# Altium schematic sheet SwitchingPowerSupplyCourse.SchDoc
size A3
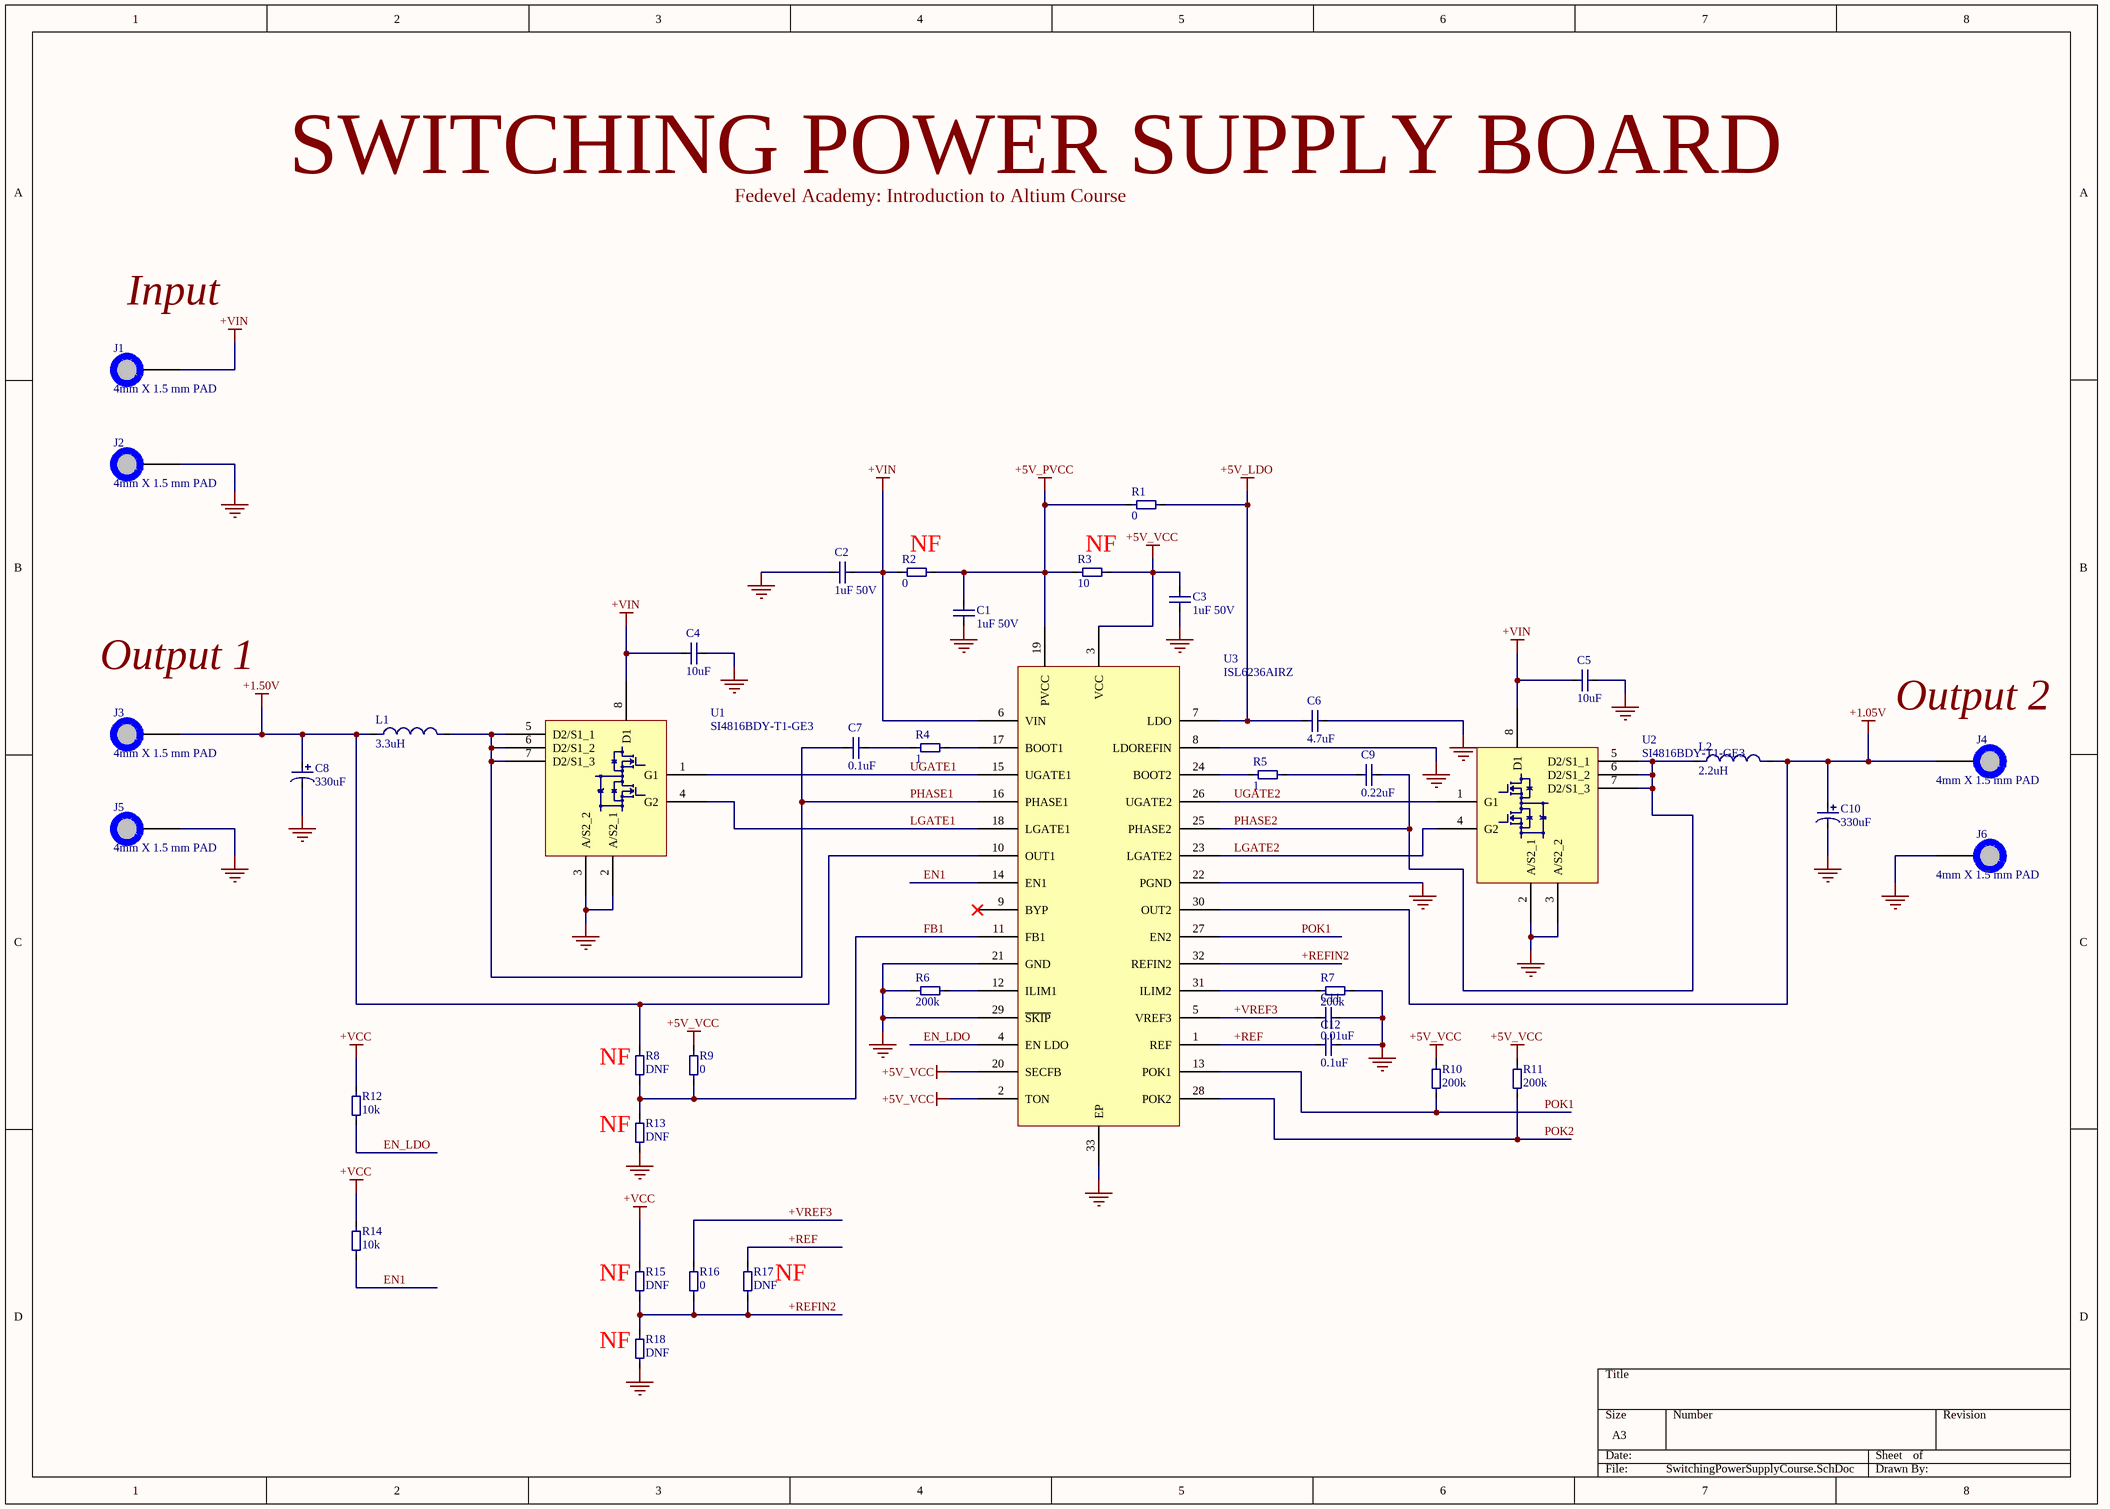
[diagram p0: SwitchingPowerSupplyCourse.SchDoc]

## Parts
C1  1uF 50V  [C0805]
C2  1uF 50V  [C0805]
C3  1uF 50V  [C0805]
C4  10uF  [C1210]
C5  10uF  [C1210]
C6  4.7uF  [C1206]
C7  0.1uF  [C0805]
C8  330uF  [7343-31]
C9  0.22uF  [C0805]
C10  330uF  [7343-31]
C11  0.01uF  [C0805]
C12  0.1uF  [C0805]
J1  4mm X 1.5 mm PAD  [PAD_WITH_HOLE_4mmX1.5mm]
J2  4mm X 1.5 mm PAD  [PAD_WITH_HOLE_4mmX1.5mm]
J3  4mm X 1.5 mm PAD  [PAD_WITH_HOLE_4mmX1.5mm]
J4  4mm X 1.5 mm PAD  [PAD_WITH_HOLE_4mmX1.5mm]
J5  4mm X 1.5 mm PAD  [PAD_WITH_HOLE_4mmX1.5mm]
J6  4mm X 1.5 mm PAD  [PAD_WITH_HOLE_4mmX1.5mm]
L1  3.3uH  [SRP1265A]
L2  2.2uH  [SRP1265A]
R1  0  [R0805]
R2  0  [R0805]
R3  10  [R0805]
R4  1  [R0805]
R5  1  [R0805]
R6  200k  [R0805]
R7  200k  [R0805]
R8  DNF  [R0805]
R9  0  [R0805]
R10  200k  [R0805]
R11  200k  [R0805]
R12  10k  [R0805]
R13  DNF  [R0805]
R14  10k  [R0805]
R15  DNF  [R0805]
R16  0  [R0805]
R17  DNF  [R0805]
R18  DNF  [R0805]
U1  SI4816BDY-T1-GE3  [SO-8]
U2  SI4816BDY-T1-GE3  [SO-8]
U3  ISL6236AIRZ  [L32.5x5B]

## Nets
+1.05V: C10.1 J4.1 L2.2 U3.30(OUT2)
+1.50V: C8.1 J3.1 L1.1 R8.2 U3.10(OUT1)
+5V_LDO: C6.2 R1.2 U3.7(LDO)
+5V_PVCC: C1.2 R1.1 R2.2 R3.1 U3.19(PVCC)
+5V_VCC: C3.1 R3.2 R9.2 R10.1 R11.1 U3.2(TON) U3.3(VCC) U3.20(SECFB)
+VCC: R12.2 R14.2 R15.2
+VIN: C2.2 C4.1 C5.1 J1.1 R2.1 U1.8(D1) U2.8(D1) U3.6(VIN)
GND: C1.1 C2.1 C3.2 C4.2 C5.2 C6.1 C8.2 C10.2 C11.2 C12.2 J2.1 J5.1 J6.1 R6.1 R7.2 R13.1 R18.1 U1.2(A/S2_1) U1.3(A/S2_2) U2.2(A/S2_1) U2.3(A/S2_2) U3.8(LDOREFIN) U3.21(GND) U3.22(PGND) U3.29(~{SKIP}) U3.33(EP)
+REF: C12.1 R17.2 U3.1(REF)
+REFIN2: R15.1 R16.1 R17.1 R18.2 U3.32(REFIN2)
+VREF3: C11.1 R16.2 U3.5(VREF3)
EN1: R14.1 U3.14(EN1)
EN_LDO: R12.1 U3.4(EN_LDO)
FB1: R8.1 R9.1 R13.2 U3.11(FB1)
LGATE1: U1.4(G2) U3.18(LGATE1)
LGATE2: U2.4(G2) U3.23(LGATE2)
PHASE1: C7.1 L1.2 U1.5(D2/S1_1) U1.6(D2/S1_2) U1.7(D2/S1_3) U3.16(PHASE1)
PHASE2: C9.2 L2.1 U2.5(D2/S1_1) U2.6(D2/S1_2) U2.7(D2/S1_3) U3.25(PHASE2)
POK1: R10.2 U3.13(POK1) U3.27(EN2)
POK2: R11.2 U3.28(POK2)
UGATE1: U1.1(G1) U3.15(UGATE1)
UGATE2: U2.1(G1) U3.26(UGATE2)
NetC7_2: C7.2 R4.1
NetC9_1: C9.1 R5.2
NetR4_2: R4.2 U3.17(BOOT1)
NetR5_1: R5.1 U3.24(BOOT2)
NetR6_2: R6.2 U3.12(ILIM1)
NetR7_1: R7.1 U3.31(ILIM2)

Not connected (* = marked no-connect by the designer): U3 9(BYP)*

## Notes on the sheet
- SWITCHING POWER SUPPLY BOARD
- Fedevel Academy: Introduction to Altium Course
- Input
- (near R2) NF
- (near R3) NF
- Output 1
- (near J4) Output 2
- (near R8) NF
- (near R13) NF
- (near R15) NF
- (near R17) NF
- (near R18) NF

## Library data of the parts
C1-C3 = UMK212F105ZG-T: Multilayer Ceramic Capacitors MLCC - SMD/SMT CAP MLCC 0805 50V Y5V 1uF +80/-20%; Manufacturer: Taiyo Yuden; Tolerance: - 20 %, + 80 %; Type: Industrial/Automotive and Safety; Case Height: 1.25 mm; Case Length: 2 mm; Supplier 1: Mouser; Manufacturer Part Number: UMK212F105ZG-T; RoHS: RoHS Compliant; Category: Multilayer Ceramic Capacitors MLCC - SMD/SMT; Stock 1: 113811; Pricing 1: 1=0.088, 10=0.036, 100=0.022, 1000=0.017, 3000=0.013, 9000=0.011, 45000=0.010 (EUR); Capacitance: 1 uF; Operating Temperature Range: - 55 C to + 125 C; Package/Case: 0805 (2012 metric); Packaging: Reel; Product: General Type MLCCs; Series: M; Termination Style: SMD/SMT; Voltage Rating: 50 V; Brand: Taiyo Yuden; Case Code - in: 0805; Case Code - mm: 2012; Case Width: 1.25 mm; Standard Pack Qty: 3000; Temperature Coefficient/Code: Y5V; RoHS - Mouser: Y; Minimum Order Quantity: 1; Reeling: True; ComponentLink1URL: http://www.yuden.co.jp/productdata/catalog/en/mlcc01_e.pdf; ComponentLink1Description: http://www.yuden.co.jp/productdata/catalog/en/mlcc01_e.pdf
C4 C5 = UMK325BJ106MM-T: Multilayer Ceramic Capacitors MLCC - SMD/SMT CAP MLCC 1210 50V X5R 10uF 20%; Manufacturer: Taiyo Yuden; Type: Industrial/Automotive and Safety; Case Height: 2.5 mm; Case Length: 3.2 mm; Supplier 1: Mouser; Manufacturer Part Number: UMK325BJ106MM-T; RoHS: RoHS Compliant; Category: Multilayer Ceramic Capacitors MLCC - SMD/SMT; Stock 1: 208606; Pricing 1: 1=0.448, 10=0.256, 100=0.128, 500=0.128, 1000=0.102, 5000=0.096, 10000=0.088, 25000=0.086, 50000=0.083, 100000=0.081 (EUR); Capacitance: 10 uF; Operating Temperature Range: - 55 C to + 125 C; Package/Case: 1210 (3225 metric); Packaging: Reel; Product: General Type MLCCs; Series: M; Termination Style: SMD/SMT; Tolerance: 20 %; Voltage Rating: 50 V; Brand: Taiyo Yuden; Case Code - in: 1210; Case Code - mm: 3225; Case Width: 2.5 mm; Standard Pack Qty: 500; Temperature Coefficient/Code: X5R; RoHS - Mouser: Y; Minimum Order Quantity: 1; Reeling: True; ComponentLink1URL: http://www.yuden.co.jp/productdata/catalog/en/mlcc01_e.pdf; ComponentLink1Description: http://www.yuden.co.jp/productdata/catalog/en/mlcc01_e.pdf
C6 = 1206ZD475KAT2A: Multilayer Ceramic Capacitors MLCC - SMD/SMT 1206 4.7uF 10volts X5R 10%; Manufacturer: AVX; Type: Commercial Surface Mount Chip; Voltage Rating: 10 V; Case Height: 0.07 mm; Case Length: 3.2 mm; Case Width: 1.6 mm; Supplier 1: Mouser; Manufacturer Part Number: 1206ZD475KAT2A; RoHS: RoHS Compliant By Exemption; Category: Multilayer Ceramic Capacitors MLCC - SMD/SMT; Stock 1: 2430; Pricing 1: 1=0.216, 50=0.172, 100=0.091, 500=0.074, 1000=0.068, 2000=0.061, 4000=0.056, 8000=0.054, 12000=0.046 (EUR); Capacitance: 4.7 uF; Operating Temperature Range: - 55 C to + 85 C; Package/Case: 1206 (3216 metric); Packaging: Reel; Product: General Type MLCCs; Series: 1206; Termination Style: SMD/SMT; Tolerance: 10 %; Brand: AVX; Case Code - in: 1206; Case Code - mm: 3216; Product Category: High Capacitance SMD Ceramic Chip Capacitors; Standard Pack Qty: 2000; Temperature Coefficient/Code: X5R; RoHS - Mouser: E; Minimum Order Quantity: 1; Reeling: True; ComponentLink1URL: http://www.avx.com/docs/Catalogs/cx5r.pdf; ComponentLink1Description: http://www.avx.com/docs/Catalogs/cx5r.pdf
C7 C12 = 0805J0500104KJT: Multilayer Ceramic Capacitors MLCC - SMD/SMT 50volts 0.1uF 10%; Manufacturer: Syfer; Type: X7R MLC Capacitor; Voltage Rating: 50 V; Temperature Coefficient/Code: X7R; Product Status: New at Mouser; Supplier 1: Mouser; Manufacturer Part Number: 0805J0500104KJT; RoHS: RoHS Compliant; Category: Multilayer Ceramic Capacitors MLCC - SMD/SMT; Stock 1: 0; Pricing 1: 1=0.048, 50=0.047, 100=0.044, 500=0.041, 1000=0.034, 3000=0.030, 6000=0.029, 9000=0.027, 12000=0.022 (EUR); Capacitance: 0.1 uF; Operating Temperature Range: - 55 C to + 125 C; Package/Case: 0805 (2012 metric); Packaging: Reel; Product: General Type MLCCs; Series: PSL; Termination Style: SMD/SMT; Tolerance: 10 %; Brand: Syfer; Case Code - in: 0805; Case Code - mm: 2012; Maximum Operating Temperature: + 125 C; Minimum Operating Temperature: - 55 C; RoHS - Mouser: Y; Minimum Order Quantity: 1; Reeling: True; ComponentLink1URL: http://www.mouser.com/ds/2/394/SL-335134.pdf; ComponentLink1Description: http://www.mouser.com/ds/2/394/SL-335134.pdf
C8 C10 = T495D337K010ATE150: Tantalum Capacitors - Solid SMD 10volts 330uF 10% ESR=150mOhms; Manufacturer: Kemet; Mfr Case Code: D Case; Voltage Rating: 10 V; Case Length: 7.3 mm; Case Width: 4.3 mm; Supplier 1: Mouser; Manufacturer Part Number: T495D337K010ATE150; RoHS: RoHS Compliant; Category: Tantalum Capacitors - Solid SMD; Stock 1: 11010; Pricing 1: 1=1.47, 10=1.01, 100=0.777, 500=0.660, 1000=0.582, 2500=0.546 (EUR); Capacitance: 330 uF; Height: 3.1 mm; Operating Temperature Range: - 55 C to + 125 C; Package/Case: 2917 (7343 metric); Packaging: Reel; Product: Tantalum Solid Low ESR Industrial Grade; Series: T495; Termination Style: SMD/SMT; Tolerance: 10 %; Brand: Kemet; ESR: 150 mOhms; Case Code - in: 2917; Case Code - mm: 7343; Product Category: SMD Low ESR Tantalum Chip Capacitors; Standard Pack Qty: 500; RoHS - Mouser: Y; Minimum Order Quantity: 1; Reeling: True; ComponentLink1URL: http://www.mouser.com/ds/2/212/KEM_T2009_T495-225625.pdf; ComponentLink1Description: http://www.mouser.com/ds/2/212/KEM_T2009_T495-225625.pdf
C9 = UMK212B7224KG-T: Multilayer Ceramic Capacitors MLCC - SMD/SMT CAP MLCC 0805 50V X7R 0.22uF 10%; Manufacturer: Taiyo Yuden; Type: Industrial/Automotive and Safety; Case Height: 1.25 mm; Case Length: 2 mm; Supplier 1: Mouser; Manufacturer Part Number: UMK212B7224KG-T; RoHS: RoHS Compliant; Category: Multilayer Ceramic Capacitors MLCC - SMD/SMT; Stock 1: 25331; Pricing 1: 1=0.096, 10=0.038, 100=0.022, 1000=0.018, 3000=0.014, 9000=0.013, 24000=0.012, 99000=0.011 (EUR); Capacitance: 0.22 uF; Operating Temperature Range: - 55 C to + 125 C; Package/Case: 0805 (2012 metric); Packaging: Reel; Product: General Type MLCCs; Series: M; Termination Style: SMD/SMT; Tolerance: 10 %; Voltage Rating: 50 V; Brand: Taiyo Yuden; Case Code - in: 0805; Case Code - mm: 2012; Case Width: 1.25 mm; Standard Pack Qty: 3000; Temperature Coefficient/Code: X7R; RoHS - Mouser: Y; Minimum Order Quantity: 1; Reeling: True; ComponentLink1URL: http://www.yuden.co.jp/productdata/catalog/en/mlcc01_e.pdf; ComponentLink1Description: http://www.yuden.co.jp/productdata/catalog/en/mlcc01_e.pdf
C11 = VJ0805Y103JXAPW1BC: Multilayer Ceramic Capacitors MLCC - SMD/SMT 0805 0.01uF 50volts X7R 5%; Manufacturer: Vishay / Vitramon; Type: Ultra Small Commodity MLCCs; Voltage Rating: 50 V; Case Height: 1.45 mm; Case Length: 2 mm; Case Width: 1.25 mm; Dissipation Factor DF: 2.5; Supplier 1: Mouser; Manufacturer Part Number: VJ0805Y103JXAPW1BC; RoHS: RoHS Compliant; Category: Multilayer Ceramic Capacitors MLCC - SMD/SMT; Stock 1: 9873; Pricing 1: 1=0.048, 50=0.016, 100=0.013, 500=0.011, 1000=0.010, 15000=0.008, 75000=0.007 (EUR); Capacitance: 0.01 uF; Operating Temperature Range: - 55 C to + 125 C; Package/Case: 0805 (2012 metric); Packaging: Reel; Product: General Type MLCCs; Series: VJ W1BC; Termination Style: SMD/SMT; Tolerance: 5 %; Brand: Vishay / Vitramon; Case Code - in: 0805; Case Code - mm: 2012; Product Category: Ceramic Chip Capacitors; Standard Pack Qty: 15000; Temperature Coefficient/Code: X7R; RoHS - Mouser: Y; Minimum Order Quantity: 1; Reeling: True; ComponentLink1URL: http://www.mouser.com/ds/2/427/vjw1bcbascomseries-223529.pdf; ComponentLink1Description: http://www.mouser.com/ds/2/427/vjw1bcbascomseries-223529.pdf
J1-J6 = 4mmX1.5mm_PAD: Elliptical pad 4mm x 1.5 mm
L1 = SRP1265A-3R3M: Fixed Inductors 3.3uH 20% SMD 1265; Manufacturer: Bourns; Core Material: Carbonyl Iron Powder; Maximum DC Current: 30 A; Maximum DC Resistance: 6.8 mOhms; Shielding: Shielded; Type: Shielded Power Inductor; Case Height: 6.2 mm; Case Length: 13.5 mm; Case Width: 12.5 mm; Test Frequency: 100 kHz; Product Status: New at Mouser; Supplier 1: Mouser; Manufacturer Part Number: SRP1265A-3R3M; RoHS: RoHS Compliant; Category: Fixed Inductors; Stock 1: 500; Pricing 1: 1=1.19, 10=0.959, 50=0.889, 100=0.847, 250=0.773, 500=0.535, 1000=0.526, 2500=0.513, 5000=0.483 (EUR); Inductance: 3.3 uH; Operating Temperature Range: - 40 C to + 150 C; Packaging: Reel; Product: Power Inductors; Series: SRP1265A; Termination Style: SMD/SMT; Tolerance: 20 %; Brand: Bourns; RoHS - Mouser: Y; Minimum Order Quantity: 1; Reeling: True; ComponentLink1URL: http://www.mouser.com/ds/2/54/bourns_SRP1265A-338573.pdf; ComponentLink1Description: http://www.mouser.com/ds/2/54/bourns_SRP1265A-338573.pdf
L2 = SRP1265A-2R2M: Fixed Inductors 2.2uH 20% SMD 1265; Manufacturer: Bourns; Core Material: Carbonyl Iron Powder; Maximum DC Current: 37 A; Maximum DC Resistance: 4.2 mOhms; Shielding: Shielded; Type: Shielded Power Inductor; Case Height: 6.2 mm; Case Length: 13.5 mm; Case Width: 12.5 mm; Test Frequency: 100 kHz; Product Status: New at Mouser; Supplier 1: Mouser; Manufacturer Part Number: SRP1265A-2R2M; RoHS: RoHS Compliant; Category: Fixed Inductors; Stock 1: 246; Pricing 1: 1=1.19, 10=0.959, 50=0.889, 100=0.847, 250=0.773, 500=0.535, 1000=0.526, 2500=0.513, 5000=0.483 (EUR); Inductance: 2.2 uH; Operating Temperature Range: - 40 C to + 150 C; Packaging: Reel; Product: Power Inductors; Series: SRP1265A; Termination Style: SMD/SMT; Tolerance: 20 %; Brand: Bourns; RoHS - Mouser: Y; Minimum Order Quantity: 1; Reeling: True; ComponentLink1URL: http://www.mouser.com/ds/2/54/bourns_SRP1265A-338573.pdf; ComponentLink1Description: http://www.mouser.com/ds/2/54/bourns_SRP1265A-338573.pdf
R1 R2 R9 R16 = RK73Z2ATTD: Thick Film Resistors - SMD ZEROohms JUMPER; Manufacturer: KOA Speer; Resistance: 0 Ohms; Case Height: 0.5 mm; Case Length: 2 mm; Case Width: 1.25 mm; Supplier 1: Mouser; Manufacturer Part Number: RK73Z2ATTD; RoHS: RoHS Compliant By Exemption; Category: Thick Film Resistors - SMD; Stock 1: 872384; Pricing 1: 1=0.064, 10=0.010, 100=0.005, 1000=0.003, 5000=0.002 (EUR); Operating Temperature Range: - 55 C to + 155 C; Package/Case: 0805 (2012 metric); Packaging: Reel; Power Rating: -; Product: Thick Film Resistors Zero-Ohm; Series: RK73Z; Temperature Coefficient: -; Tolerance: -; Voltage Rating: -; Brand: KOA Speer; Case Code - in: 0805; Case Code - mm: 2012; Product Category: 0805 SMD Thick Film Chip Resistors; Standard Pack Qty: 5000; RoHS - Mouser: E; Minimum Order Quantity: 1; Reeling: True; ComponentLink1URL: http://www.mouser.com/ds/2/219/RK73Z-11765.pdf; ComponentLink1Description: http://www.mouser.com/ds/2/219/RK73Z-11765.pdf
R3 = CRCW080510R0FKEA: Thick Film Resistors - SMD 1/8watt 10ohms 1% 100ppm; Manufacturer: Vishay / Dale; Power Rating: 125 mW (1/8 W); Temperature Coefficient: 100 PPM / K; Voltage Rating: 150 V; Case Height: 0.45 mm; Case Length: 2 mm; Case Width: 1.25 mm; Supplier 1: Mouser; Manufacturer Part Number: CRCW080510R0FKEA; RoHS: RoHS Compliant By Exemption; Category: Thick Film Resistors - SMD; Stock 1: 355552; Pricing 1: 1=0.064, 10=0.038, 100=0.022, 1000=0.014, 5000=0.004, 100000=0.003 (EUR); Operating Temperature Range: - 55 C to + 155 C; Package/Case: 0805 (2012 metric); Packaging: Reel; Product: Thick Film Resistors SMD; Resistance: 10 Ohms; Series: CRCW; Tolerance: 1 %; Brand: Vishay / Dale; Case Code - in: 0805; Case Code - mm: 2012; Product Category: 0805 Thick Film Chip Resistors; Standard Pack Qty: 5000; RoHS - Mouser: E; Minimum Order Quantity: 1; Reeling: True; ComponentLink1URL: http://www.mouser.com/ds/2/427/dcrcwe3-109170.pdf; ComponentLink1Description: http://www.mouser.com/ds/2/427/dcrcwe3-109170.pdf
R4 R5 = CRCW08051R00FKEA: Thick Film Resistors - SMD 1/8watt 1ohms 100ppm; Manufacturer: Vishay / Dale; Power Rating: 125 mW (1/8 W); Temperature Coefficient: 100 PPM / K; Tolerance: 1 %; Voltage Rating: 150 V; Case Height: 0.45 mm; Case Length: 2 mm; Case Width: 1.25 mm; Supplier 1: Mouser; Manufacturer Part Number: CRCW08051R00FKEA; RoHS: RoHS Compliant By Exemption; Category: Thick Film Resistors - SMD; Stock 1: 93546; Pricing 1: 1=0.064, 10=0.038, 100=0.022, 1000=0.014, 5000=0.004, 100000=0.003 (EUR); Operating Temperature Range: - 55 C to + 155 C; Package/Case: 0805 (2012 metric); Packaging: Reel; Product: Thick Film Resistors SMD; Resistance: 1 Ohms; Series: CRCW; Brand: Vishay / Dale; Case Code - in: 0805; Case Code - mm: 2012; Product Category: 0805 Thick Film Chip Resistors; Standard Pack Qty: 5000; RoHS - Mouser: E; Minimum Order Quantity: 1; Reeling: True; ComponentLink1URL: http://www.mouser.com/ds/2/427/dcrcwe3-109170.pdf; ComponentLink1Description: http://www.mouser.com/ds/2/427/dcrcwe3-109170.pdf
R6 R7 R10 R11 = RK73H2ATTD2003F: Thick Film Resistors - SMD 1/8watts 200Kohms 1%; Manufacturer: KOA Speer; Power Rating: 125 mW (1/8 W); Temperature Coefficient: 100 PPM / C; Voltage Rating: 150 V; Case Height: 0.5 mm; Case Length: 2 mm; Case Width: 1.25 mm; Supplier 1: Mouser; Manufacturer Part Number: RK73H2ATTD2003F; RoHS: RoHS Compliant By Exemption; Category: Thick Film Resistors - SMD; Stock 1: 67759; Pricing 1: 1=0.064, 10=0.011, 100=0.006, 5000=0.003, 10000=0.002 (EUR); Operating Temperature Range: - 55 C to + 155 C; Package/Case: 0805 (2012 metric); Packaging: Reel; Product: Thick Film Resistors SMD; Resistance: 200 kOhms; Series: RK73H; Tolerance: 1 %; Brand: KOA Speer; Case Code - in: 0805; Case Code - mm: 2012; Product Category: 0805 SMD Thick Film Chip Resistors; Standard Pack Qty: 5000; RoHS - Mouser: E; Minimum Order Quantity: 1; Reeling: True; ComponentLink1URL: http://www.koaspeer.com/catimages/Products/RK73H/RK73H.pdf; ComponentLink1Description: http://www.koaspeer.com/catimages/Products/RK73H/RK73H.pdf
R8 R13 R15 R17 R18 = RES: Generic Do Not Fit Capacitor
R12 R14 = SG73P2ATTD1002F: Thick Film Resistors - SMD 0.25W 10Kohm 1% 200ppm; Manufacturer: KOA Speer; Power Rating: 250 mW (1/4 W); Resistance: 10 kOhms; Temperature Coefficient: 200 PPM / C; Voltage Rating: 150 V; Case Height: 0.5 mm; Case Length: 2 mm; Case Width: 1.25 mm; Supplier 1: Mouser; Manufacturer Part Number: SG73P2ATTD1002F; RoHS: RoHS Compliant By Exemption; Category: Thick Film Resistors - SMD; Stock 1: 866; Pricing 1: 1=0.162, 10=0.138, 100=0.119, 500=0.105, 1000=0.089, 5000=0.074, 10000=0.070, 25000=0.065, 50000=0.061 (AUD); Operating Temperature Range: - 55 C to + 155 C; Package / Case: 0805 (2012 metric); Packaging: Reel; Product: Thick Film Resistors SMD; Series: SG73; Tolerance: 1 %; Type: Surge Current Thick Film Chip Resistor; Brand: KOA Speer; Case Code - in: 0805; Case Code - mm: 2012; Standard Pack Qty: 5000; RoHS - Mouser: E; Minimum Order Quantity: 1; Reeling: True; ComponentLink1URL: http://www.koaspeer.com/catimages/Products/SG73/SG73.pdf; ComponentLink1Description: http://www.koaspeer.com/catimages/Products/SG73/SG73.pdf
U1 U2 = SI4816BDY-T1-GE3: MOSFET Dua lN-Ch w/Schottky 30V 18.5/11.5mohm; Manufacturer: Vishay / Siliconix; Configuration: Dual with Schottky Diode; Transistor Polarity: N-Channel; Channel Mode: Enhancement; Fall Time: 9 ns; Id - Continuous Drain Current: 5.8 A; Pd - Power Dissipation: 1 W, 1.25 W; Rds On - Drain-Source Resistance: 15.5 mOhms, 9.3 mOhms; Typical Turn-Off Delay Time: 24 ns, 31 ns; Vgs - Gate-Source Breakdown Voltage: 20 V; Supplier 1: Mouser; Manufacturer Part Number: SI4816BDY-T1-GE3; RoHS: RoHS Compliant; Category: MOSFET; Stock 1: 4499; Pricing 1: 1=1.06, 50=0.976, 100=0.952, 500=0.848, 1000=0.760, 2500=0.680, 5000=0.656, 10000=0.640, 15000=0.616 (EUR); Package/Case: SOIC-8 Narrow; Packaging: Reel; Brand: Vishay / Siliconix; Mounting Style: SMD/SMT; Maximum Operating Temperature: + 150 C; Minimum Operating Temperature: - 55 C; Product Category: Dual MOSFETs; Rise Time: 9 ns; Standard Pack Qty: 2500; Vds - Drain-Source Breakdown Voltage: 30 V; RoHS - Mouser: Y; Minimum Order Quantity: 1; Reeling: True; ComponentLink1URL: http://www.vishay.com/doc?73026; ComponentLink1Description: http://www.vishay.com/doc?73026
U3 = ISL6236AIRZ: Switching Controllers ISL6236 QD QUTPUT CNTRLR IMVP-6 32LD; Manufacturer: Intersil; Number of Outputs: 2; Output Current: 20000 mA; Switching Frequency: 200 KHz, 300 KHz, 400 KHz, 500 KHz; Supplier 1: Mouser; Manufacturer Part Number: ISL6236AIRZ; RoHS: RoHS Compliant; Category: Switching Controllers; Stock 1: 36; Pricing 1: 1=8.69, 25=7.06, 100=5.99, 500=4.01 (AUD); Package / Case: QFN EP; Packaging: Tube; Series: ISL6236; Brand: Intersil; Maximum Operating Temperature: + 100 C; Minimum Operating Temperature: - 40 C; Standard Pack Qty: 60; RoHS - Mouser: Y; Minimum Order Quantity: 1; Reeling: False; ComponentLink1URL: http://www.mouser.com/ds/2/465/fn6453-80078.pdf; ComponentLink1Description: http://www.mouser.com/ds/2/465/fn6453-80078.pdf; Supplier Part Number 1: 968-ISL6236AIRZ